# EAGLE design G27InterfaceBoard (EAGLE 9.6.2)
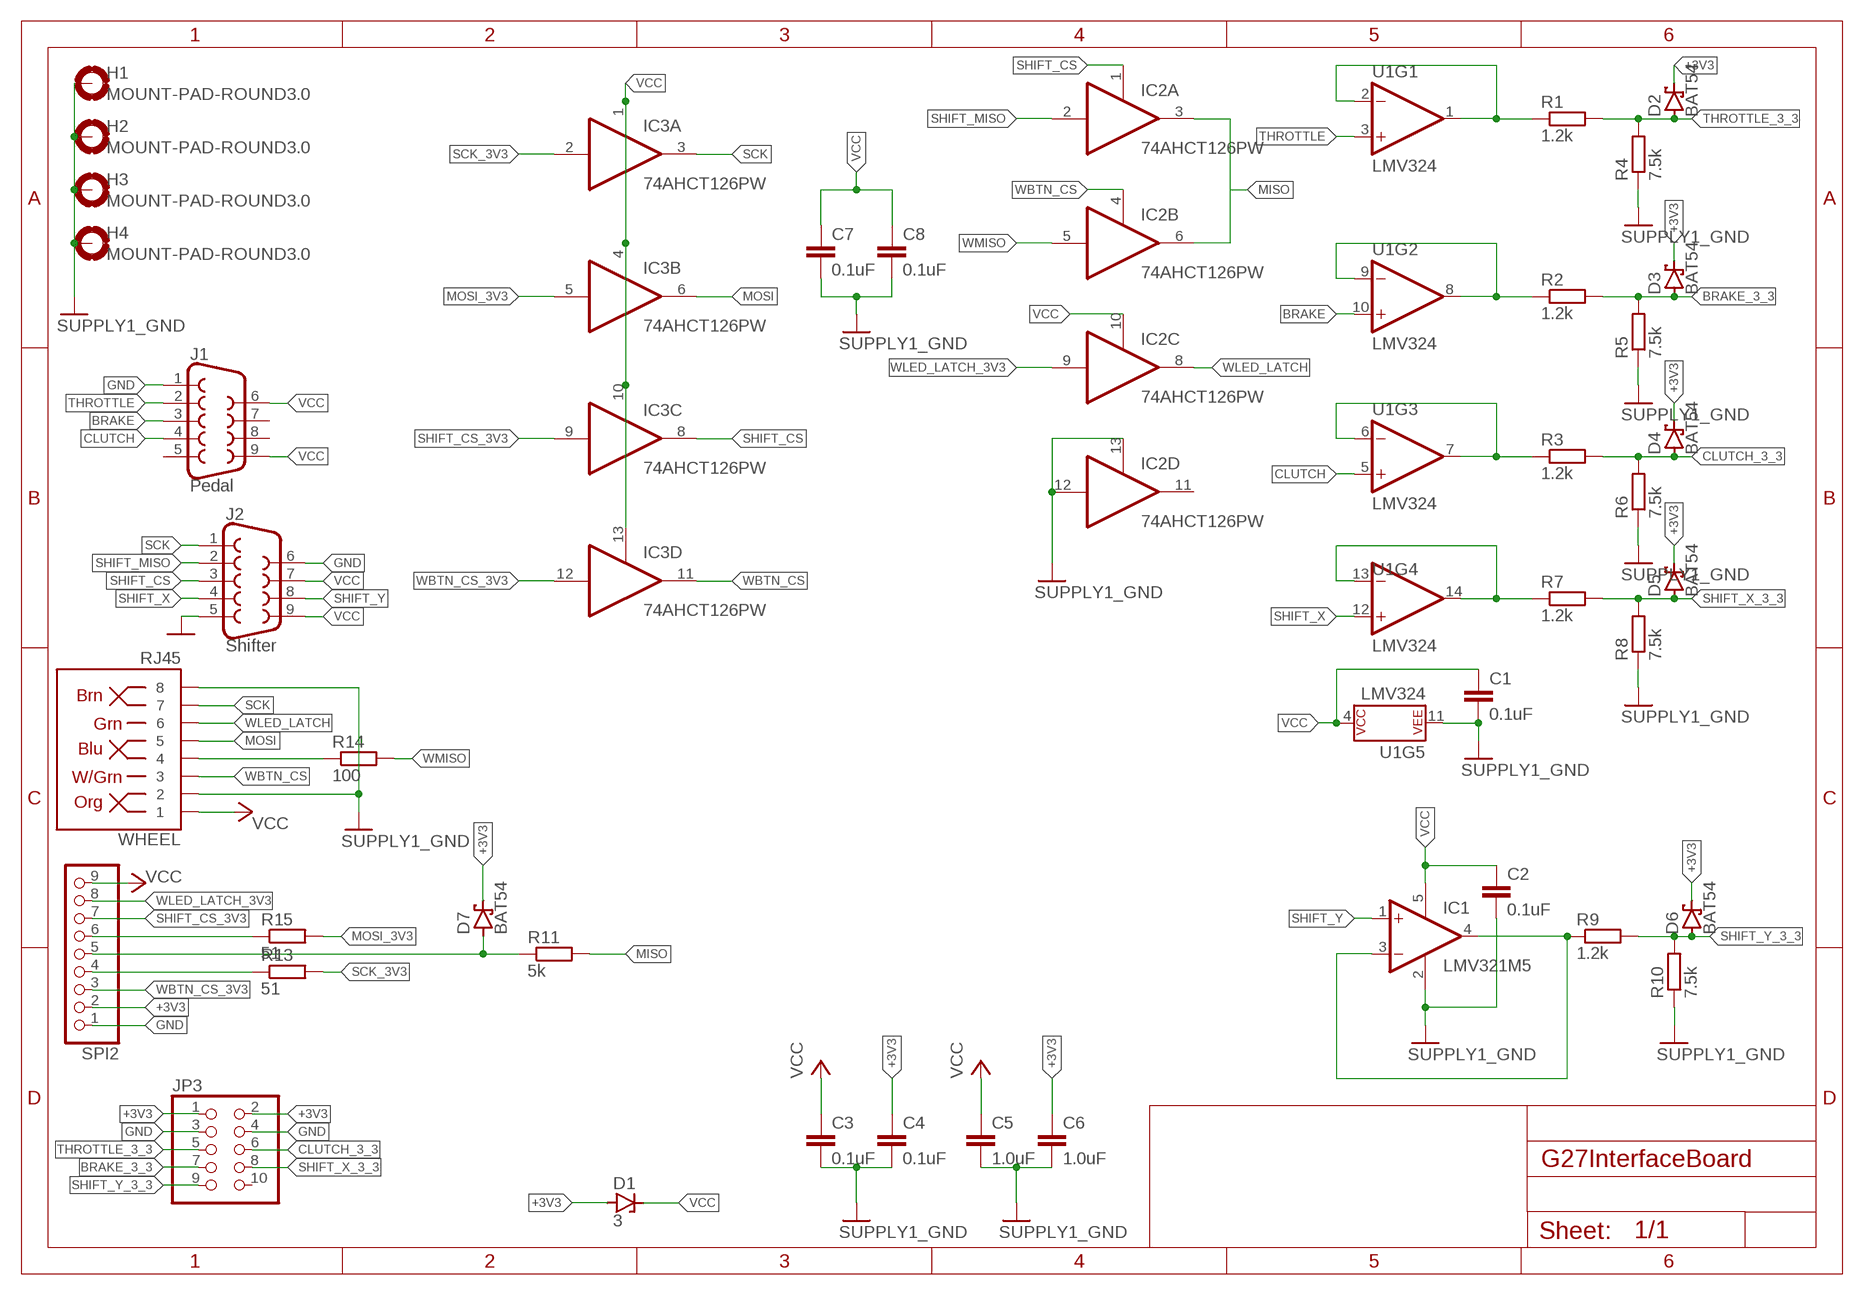
[diagram p0: schematic, sheet 1]

## Parts
C1  0.1uF  RESISTOR_C-EUC0603  [RESISTOR_C0603]
C2  0.1uF  RESISTOR_C-EUC0603  [RESISTOR_C0603]
C3  0.1uF  C-EUC0805  [C0805]
C4  0.1uF  C-EUC0805  [C0805]
C5  1.0uF  C-EUC0805  [C0805]
C6  1.0uF  C-EUC0805  [C0805]
C7  0.1uF  C-EUC0603  [C0603]
C8  0.1uF  C-EUC0603  [C0603]
D1  3  ZENER-DIODESOT23  [SOT23]
D2  BAT54  [SOT23]
D3  BAT54  [SOT23]
D4  BAT54  [SOT23]
D5  BAT54  [SOT23]
D6  BAT54  [SOT23]
D7  BAT54  [SOT23]
H1  MOUNT-PAD-ROUND3.0  [3,0-PAD]
H2  MOUNT-PAD-ROUND3.0  [3,0-PAD]
H3  MOUNT-PAD-ROUND3.0  [3,0-PAD]
H4  MOUNT-PAD-ROUND3.0  [3,0-PAD]
IC1  LMV321M5  [SOT23-5]
IC2  74AHCT126PW  [TSSOP14]
IC3  74AHCT126PW  [TSSOP14]
J1  Pedal  DB9FEMALE  [DB9]
J2  Shifter  DB9MALE  [DB9_MALE]
JP3  PINHEAD_PINHD-2X5  [PINHEAD_2X05]
R1  1.2k  R-EU_R0603  [R0603]
R2  1.2k  R-EU_R0603  [R0603]
R3  1.2k  R-EU_R0603  [R0603]
R4  7.5k  R-EU_R0603  [R0603]
R5  7.5k  R-EU_R0603  [R0603]
R6  7.5k  R-EU_R0603  [R0603]
R7  1.2k  R-EU_R0603  [R0603]
R8  7.5k  R-EU_R0603  [R0603]
R9  1.2k  R-EU_R0603  [R0603]
R10  7.5k  R-EU_R0603  [R0603]
R11  5k  R-EU_R0603  [R0603]
R13  51  R-EU_R0603  [R0603]
R14  100  R-EU_R0603  [R0603]
R15  51  R-EU_R0603  [R0603]
SPI2  PINHD-1X9  [1X09]
U1  LMV324  [SO14]
WHEEL  RJ45  RJ45-8  [RJ45-8]

## Nets
+3V3: C4.1 C6.1 D1.1(A) D2.3(C) D3.3(C) D4.3(C) D5.3(C) D6.3(C) D7.3(C) JP3.1 JP3.2 SPI2.2
BRAKE: J1.3 U1.10(+IN)
BRAKE_3_3: D3.1(A) JP3.7 R2.2 R5.2
CLUTCH: J1.4 U1.5(+IN)
CLUTCH_3_3: D4.1(A) JP3.6 R3.2 R6.2
GND: C1.2 C2.2 C3.2 C4.2 C5.2 C6.2 C7.2 C8.2 H1.B3,0(MOUNT) H2.B3,0(MOUNT) H3.B3,0(MOUNT) H4.B3,0(MOUNT) IC1.2(V-) IC2.12(D:I) IC2.13(D:OE) J1.1 J2.5 J2.6 JP3.3 JP3.4 R4.1 R5.1 R6.1 R8.1 R10.1 SPI2.1 U1.11(P$V-) WHEEL.2 WHEEL.8 ; supply symbol labelled SUPPLY1_GND
MISO: IC2.3(A:O) IC2.6(B:O) R11.2
MOSI: IC3.6(B:O) WHEEL.5
MOSI_3V3: IC3.5(B:I) R15.2
N$1: R1.1 U1.1(OUT) U1.2(-IN)
N$2: R7.1 U1.13(-IN) U1.14(OUT)
N$3: IC1.3(-IN) IC1.4(OUT) R9.1
N$4: D7.1(A) R11.1 SPI2.5
N$5: R2.1 U1.8(OUT) U1.9(-IN)
N$6: R3.1 U1.6(-IN) U1.7(OUT)
N$8: R13.1 SPI2.4
N$9: R14.1 WHEEL.4
N$10: R15.1 SPI2.6
SCK: IC3.3(A:O) J2.1 WHEEL.7
SCK_3V3: IC3.2(A:I) R13.2
SHIFT_CS: IC2.1(A:OE) IC3.8(C:O) J2.3
SHIFT_CS_3V3: IC3.9(C:I) SPI2.7
SHIFT_MISO: IC2.2(A:I) J2.2
SHIFT_X: J2.4 U1.12(+IN)
SHIFT_X_3_3: D5.1(A) JP3.8 R7.2 R8.2
SHIFT_Y: IC1.1(+IN) J2.8
SHIFT_Y_3_3: D6.1(A) JP3.9 R9.2 R10.2
THROTTLE: J1.2 U1.3(+IN)
THROTTLE_3_3: D2.1(A) JP3.5 R1.2 R4.2
VCC: C1.1 C2.1 C3.1 C5.1 C7.1 C8.1 D1.3(C) IC1.5(V+) IC2.10(C:OE) IC3.1(A:OE) IC3.4(B:OE) IC3.10(C:OE) IC3.13(D:OE) J1.6 J1.9 J2.7 J2.9 SPI2.9 U1.4(P$V+) WHEEL.1
WBTN_CS: IC2.4(B:OE) IC3.11(D:O) WHEEL.3
WBTN_CS_3V3: IC3.12(D:I) SPI2.3
WLED_LATCH: IC2.8(C:O) WHEEL.6
WLED_LATCH_3V3: IC2.9(C:I) SPI2.8
WMISO: IC2.5(B:I) R14.2
Unconnected: IC2.11(D:O) J1.5 J1.7 J1.8 JP3.10

## Power pins joined to a net without a drawn wire
GND: IC2.7(P:GND) IC3.7(P:GND)
VCC: IC2.14(P:VCC) IC3.14(P:VCC)

## Library data of the parts
C1 C2 = stm_board_f407:RESISTOR_C-EU: CAPACITOR, European symbol
C3-C8 = resistor:C-EU: CAPACITOR, European symbol
D1 = diode:ZENER-DIODE: Z-Diode; SPICEPREFIX: D
D2-D7 = diode:BAT54: Schottky Diodes Source: Fairchild .. BAT54.pdf
H1-H4 = holes:MOUNT-PAD-ROUND: MOUNTING PAD, round
IC1 = linear:LMV321?*: General Purpose, Low Voltage, Rail-to-Rail Output Operational Amplifiers Source: http://www.national.com/mpf/LM/LMV321.html http://www.national.com/dt/lmv_qual.pdf
IC2 IC3 = 74xx-eu:74*126: Quad bus BUFFER, 3-state
J1 = SparkFun-Connectors:DB9: DB9 Connector Standard DB9 (D-Sub 9) serial connector. Can be used for CAN bus as well as RS485 and RS232. Footprint production proven. Here is the female version connector we sell at SparkFun: 9 Pin Female Serial Connector - PCB Mount <https://www.sparkfun.com/products/429> (PRT-00429) This connector has been used on the following SparkFun products: SparkFun RS232 Shifter - SMD <https://www.sparkfun.com/products/449> (PRT-00449) SparkFun RS232 Shifter SMD (No DB9) <https://www.sparkfun.com/products/8780> (PRT-08780); PROD_ID: CONN-08194
J2 = SparkFun-Connectors:DB9: DB9 Connector Standard DB9 (D-Sub 9) serial connector. Can be used for CAN bus as well as RS485 and RS232. Footprint production proven. Here is the female version connector we sell at SparkFun: 9 Pin Female Serial Connector - PCB Mount <https://www.sparkfun.com/products/429> (PRT-00429) This connector has been used on the following SparkFun products: SparkFun RS232 Shifter - SMD <https://www.sparkfun.com/products/449> (PRT-00449) SparkFun RS232 Shifter SMD (No DB9) <https://www.sparkfun.com/products/8780> (PRT-08780); PROD_ID: CONN-09904
JP3 = stm_board_f407:PINHEAD_PINHD-2X5: PIN HEADER
R1-R11 R13-R15 = resistor:R-EU_: RESISTOR, European symbol
SPI2 = pinhead:PINHD-1X9: PIN HEADER
U1 = SparkFun-IC-Amplifiers:LMV324: IC LMV324 Quad Op Amp Jellybean quad op-amp Datasheet <http://cdn.sparkfun.com/datasheets/Sensors/Sound/LMV324.pdf> SparkFun Products SparkFun Sensor Kit <https://www.sparkfun.com/products/13754> (DEV-13754) SparkFun Inventor's Kit for Arduino 101 <https://www.sparkfun.com/products/13844> (KIT-13844) SparkFun Sound Detector <https://www.sparkfun.com/products/12642> (SEN-12642); PROD_ID: IC-08227
WHEEL = SparkFun-Connectors:RJ45-8: RJ45 Jack - 8 pin Simple RJ45, 8-pin connection. Commonly used for Cat5, Cat5e, and Cat6 Ethernet cables. Here is the connector we sell at SparkFun: RJ45 8-Pin Connector <https://www.sparkfun.com/products/643> (PRT-00643) Datasheet <https://cdn.sparkfun.com/datasheets/Prototyping/04908.pdf> It is used on this SparkFun product: SparkFun RJ45 Breakout <https://www.sparkfun.com/products/716> (BOB-00716) Note, you may also be interested in the "MAGJACK" version of this. It is basically a RJ45 connector, but also has some status LEDs built into the connector housing. You can check that out in this library at the device named "MAGJACK.dev" and see these products online: RJ45 Ethernet MagJack-Compatible <https://www.sparkfun.com/products/8534> (PRT-08534) SparkFun RJ45 MagJack Breakout <https://www.sparkfun.com/products/13021> (BOB-13021); PROD_ID: CONN-08506; SF_ID: PRT-00643

## Board
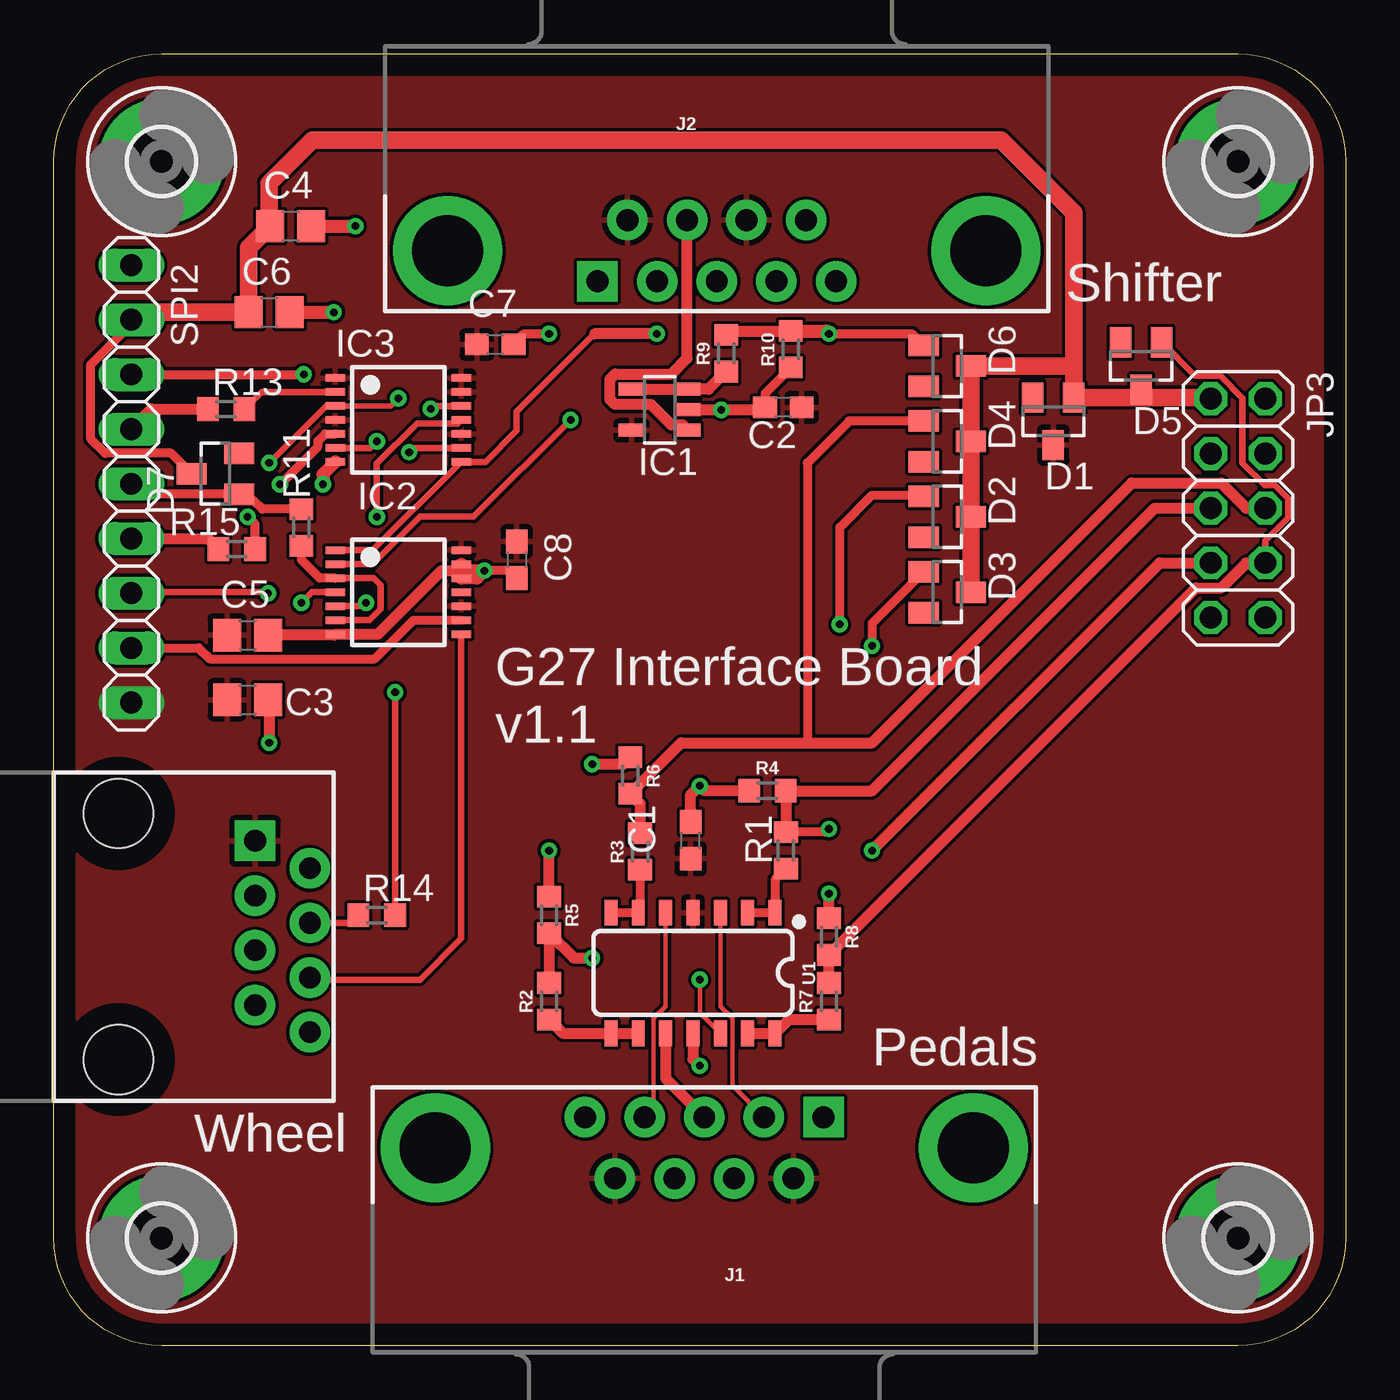
[diagram p1: board, top side]
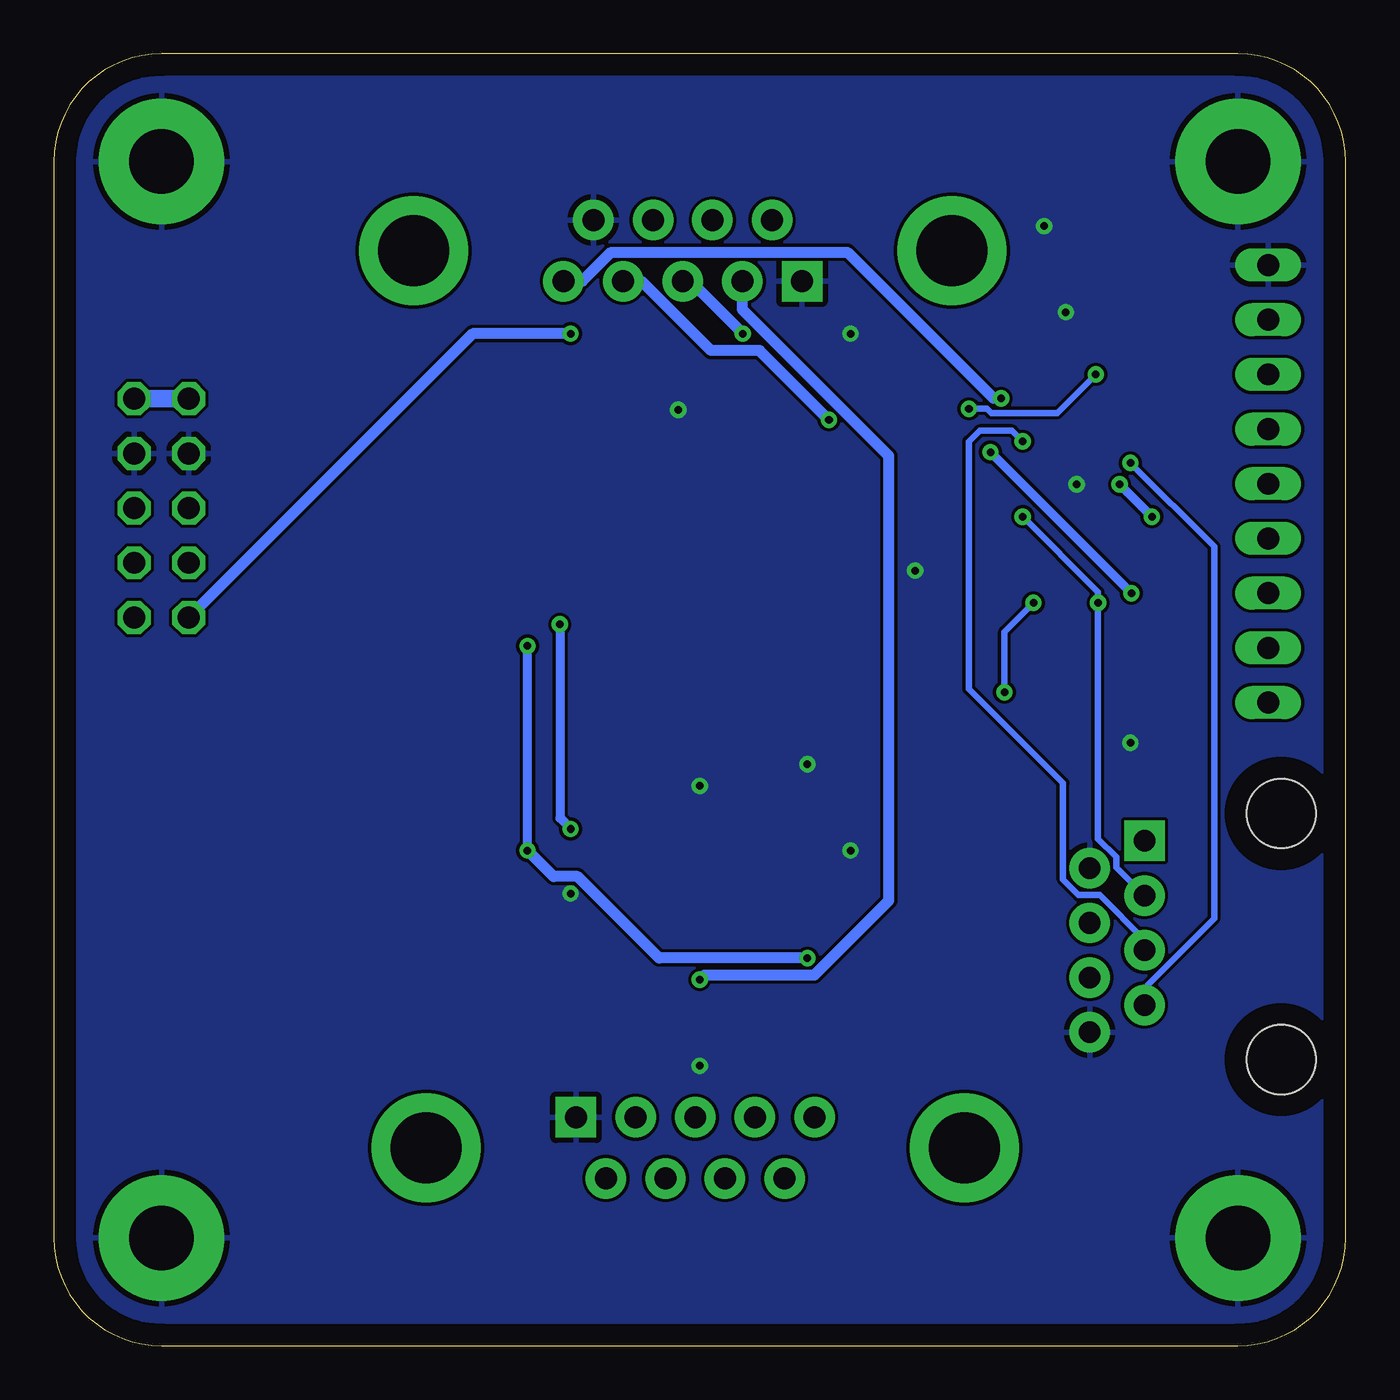
[diagram p2: board, bottom side, seen from below]

Size 60 x 60 mm. Coordinates in mm from the lower left corner, seen from the top.
Outline: 55,0 5,0 arc-90 0,5 0,55 arc-90 5,60 55,60 arc-90 60,55 60,5 arc-90 55,0
Copper layers (1*16): Top 0.035mm / dielectric 1.5mm / Bottom 0.035mm
Design rules "jlcpcb": minimum track width 5mil, minimum drill 0.3mm, track to track 6mil, track to pad 6mil, pad to pad 6mil, via to via 6mil, smd to smd 6mil, copper to edge 40mil, drill to drill 6mil, minimum pad ring 10mil, minimum via ring 8mil, stop-mask expansion 4mil, vias tented up to drill 0mil, thermal gap 10mil

### Footprints (pad centres in the part's own frame; a part is rotated, then mirrored left to right if it is on the bottom)
RESISTOR_C0603 = smd 1.1 x 1: 1 -0.85,0; 2 0.85,0
C0805 = smd 1.3 x 1.5: 1 -0.95,0; 2 0.95,0
C0603 = smd 1.1 x 1: 1 -0.85,0; 2 0.85,0
SOT23 = smd 1 x 1.4: 1 -0.95,-1.1; 2 0.95,-1.1; 3 0,1.1
3,0-PAD = drill 3 pad 5.842: B3,0 0,0
SOT23-5 = smd 0.6 x 1.2: 1 -0.95,-1.306; 2 0,-1.306; 3 0.95,-1.306; 4 0.95,1.306; 5 -0.95,1.306
TSSOP14 = smd 0.35 x 0.9: 1 -1.95,-2.925; 2 -1.3,-2.925; 3 -0.65,-2.925; 4 0,-2.925; 5 0.65,-2.925; 6 1.3,-2.925; 7 1.95,-2.925; 8 1.95,2.925; 9 1.3,2.925; 10 0.65,2.925; 11 0,2.925; 12 -0.65,2.925; 13 -1.3,2.925; 14 -1.95,2.925
DB9 = drill 1.016 pad 1.88 square: 1 -5.54,-1.42 | drill 1.016 pad 1.88: 2 -2.77,-1.42; 3 0,-1.42; 4 2.77,-1.42; 5 5.54,-1.42; 6 -4.15,1.42; 7 -1.38,1.42; 8 1.38,1.42; 9 4.15,1.42 | drill 3.302 pad 5.08: G1 -12.5,0; G2 12.5,0
DB9_MALE = drill 1.016 pad 1.88: 1 5.54,-1.42; 2 2.77,-1.42; 3 0,-1.42; 4 -2.77,-1.42; 6 4.15,1.42; 7 1.38,1.42; 8 -1.38,1.42; 9 -4.15,1.42 | drill 1.016 pad 1.88 square: 5 -5.54,-1.42 | drill 3.302 pad 5.08: G1 -12.5,0; G2 12.5,0
PINHEAD_2X05 = drill 1.016 octagon: 1 -5.08,-1.27; 2 -5.08,1.27; 3 -2.54,-1.27; 4 -2.54,1.27; 5 0,-1.27; 6 0,1.27; 7 2.54,-1.27; 8 2.54,1.27; 9 5.08,-1.27; 10 5.08,1.27
R0603 = smd 1 x 1.1: 1 -0.85,0; 2 0.85,0
1X09 = drill 1.016 long: 1 -10.16,0; 2 -7.62,0; 3 -5.08,0; 4 -2.54,0; 5 0,0; 6 2.54,0; 7 5.08,0; 8 7.62,0; 9 10.16,0
SO14 = smd 0.6 x 1.2: 1 -3.175,-2.8; 2 -1.905,-2.8; 3 -0.635,-2.8; 4 0.635,-2.8; 5 1.905,-2.8; 6 3.175,-2.8; 7 4.445,-2.8; 8 4.445,2.8; 9 3.175,2.8; 10 1.905,2.8; 11 0.635,2.8; 12 -0.635,2.8; 13 -1.905,2.8; 14 -3.175,2.8
RJ45-8 = drill 1 pad 1.88 square: 1 -4.445,6.35 | drill 1 pad 1.88: 2 -3.175,8.89; 3 -1.905,6.35; 4 -0.635,8.89; 5 0.635,6.35; 6 1.905,8.89; 7 3.175,6.35; 8 4.445,8.89 | hole 3.2: -5.715,0; 5.715,0

### Placement (x,y rotation side)
C1  29.58,23.47 90 top
C2  33.88,43.58 180 top
C3  9,30 0 top
C4  11,52 0 top
C5  9,33 0 top
C6  10,48 0 top
C7  20.5,46.5 0 top
C8  21.5,36.5 270 top
D1  46.42,42.93 180 top
D2  41.5,38.5 270 top
D3  41.5,35 270 top
D4  41.5,42 270 top
D5  50.5,45.5 180 top
D6  41.5,45.5 270 top
D7  7.5,40.5 90 top
H1  5,5 0 top
H2  5,55 0 top
H3  55,5 0 top
H4  55,55 0 top
IC1  28.14,43.47 90 top
IC2  16,35 270 top
IC3  16,43 270 top
J1  30.21,9.19 180 top
J2  30.79,50.86 0 top
JP3  55,38.9 270 top
R1  34,23 90 top
R2  23,16 90 top
R3  27.23,22.95 90 top
R4  33.14,25.77 0 top
R5  23,20 270 top
R6  26.77,26.48 270 top
R7  36,16 90 top
R8  36,19 270 top
R9  31.23,46.09 90 top
R10  34.23,46.28 90 top
R11  11.5,38 270 top
R13  8,43.5 0 top
R14  15,20 0 top
R15  8.5,37 0 top
SPI2  3.6,40.03 270 top
U1  30.32,17.31 180 top
WHEEL  3,19 270 top

### Tracks (layer width: path | path; a pad name or v marks a point on that pad's centre or on a via)
+3V3
  Top 0.406: D5.3 50.5,44.03 | D7.3 5.45,41.45 2.38,41.45 1.72,42.11 1.72,45.57 3.6,47.45 SPI2.2
  Top 0.508: JP3.1 53.68,44.03
  Top 0.813: 53.68,44.03 50.5,44.03 D1.1 47.37,45.5 | 47.37,45.5 47.37,52.63 44,56 12,56 10,54 10,52.05 C4.1 9.05,51 C6.1 3.95,48 SPI2.2 | 47.37,45.5 D6.3 D4.3 D2.3 D3.3
  Bottom 0.813: JP3.2 JP3.1
BRAKE
  Top 0.508: U1.10 28.41,12.41 J1.3
BRAKE_3_3  (via drill 0.35)
  Top 0.406: D3.1 38,33.55 v38,32.5
  Top 0.508: R2.2 R5.2 24.15,18 v25,18 | JP3.7 51.36,36.36 v38,23
  Bottom 0.406: v38,23 v38,32.5
  Bottom 0.508: v38,23 36.78,21.78 35.67,21.78 31.89,18 v25,18
CLUTCH
  Top 0.203: U1.5 28.41,15.77 27.86,15.22 27.86,11.03 J1.4
CLUTCH_3_3
  Top 0.406: D4.1 36.95,42.95 35,41 35,28
  Top 0.508: R3.2 27.23,25.17 R6.2 29.14,28 35,28 38,28 50.07,40.07 54.21,40.07 55.38,38.9 JP3.6
GND  (via drill 0.35)
  Top 0.305: IC2.7 13.03,33
  Top 0.406: R10.1 33.03,44.23 C2.2 | C8.2 21.15,36 v20,36 | C7.2 21.85,47 v23,47
  Top 0.508: R8.1 v36,21 | IC1.2 v31,43.47 32.92,43.47 C2.2 | C1.2 29.58,25.58 v30,26 30.23,25.77 R4.1 | R5.1 v23,23 | U1.11 29.68,13.31 v30,13 | R6.1 26.44,27 v25,27 | IC2.7 15.05,33.05 18,36 19.23,36 | 13.03,33 C5.2 | C3.2 10,29.95 v10,28
  Top 0.61: C4.2 v14,52 | C6.2 v13,48 | IC3.7 12.5,40.48 v12.5,40 | IC2.13 19.23,36 v20,36 19.65,35.65 IC2.12
  pour Bottom: -3,61 61,61 61,-1 -3,-1
MISO
  Top 0.305: IC2.3 14.85,35.65 15.18,35.32 15.18,34.22 14.67,33.7 IC2.6
  Top 0.406: IC2.3 12.35,35.65 11.5,36.5 R11.2
MOSI  (via drill 0.35)
  Top 0.305: v15,42 14.7,41.7 IC3.6
  Bottom 0.305: WHEEL.5 9.35,18.85 11.43,20.93 12.41,20.93 13.13,21.66 13.13,26.13 17.5,30.5 17.5,42 17,42.5 15.5,42.5 v15,42
MOSI_3V3  (via drill 0.35)
  Top 0.406: R15.2 9.35,38.15 v9,38.5 | v10.5,40 12.27,41.77 12.27,42.02 12.6,42.35 IC3.5
  Bottom 0.406: v9,38.5 v10.5,40
N$1
  Top 0.406: R1.1 33.49,21.65 U1.1 U1.2
N$2
  Top 0.508: U1.13 U1.14 33.84,14.86 34.13,15.15 R7.1
N$3
  Top 0.508: IC1.4 29,44.42 IC1.3 30.41,44.42 R9.1
N$4
  Top 0.406: R11.1 9.69,38.85 9.3,39.23 8.92,39.23 D7.1 4.08,39.55 SPI2.5
N$5
  Top 0.508: R2.1 23.64,14.51 U1.8 U1.9
N$6
  Top 0.406: R3.1 27.23,20.2 U1.6 U1.7
N$8
  Top 0.508: SPI2.4 4.53,43.5 R13.1
N$9
  Top 0.305: R14.1 13.79,19.63 WHEEL.4
N$10
  Top 0.508: SPI2.6 7.16,37.49 R15.1
SCK  (via drill 0.35)
  Top 0.254: v16,44 15.65,43.65 IC3.3
  Top 0.305: v10,41 12.65,43.65 IC3.3
  Bottom 0.305: WHEEL.7 9.35,16.6 6.11,19.85 6.11,37.11 v10,41
  Bottom 0.508: J2.1 35.46,49.44 34.12,50.79 23.14,50.79 16.36,44 v16,44
SCK_3V3
  Top 0.305: R13.2 9.65,44.3 IC3.2
SHIFT_CS  (via drill 0.35)
  Top 0.305: 25.12,47 21.5,43.38 21.5,42.5 20.05,41.05 IC3.8 16.83,38.96 16.81,38.96 14.8,36.95 IC2.1
  Top 0.508: v28,47 25.12,47
  Bottom 0.508: v28,47 30.44,49.44 J2.3
SHIFT_CS_3V3  (via drill 0.35)
  Top 0.305: IC3.9 16.7,41.7 v16.5,41.5 | SPI2.7 3.65,35 10,35 v9.95,34.95
  Bottom 0.406: v9.95,34.95 v16.5,41.5
SHIFT_MISO  (via drill 0.35)
  Top 0.305: v24,43 19.5,38.5 17,38.5 14.8,36.3 IC2.2
  Bottom 0.508: v24,43 27.21,46.22 29.47,46.22 32.69,49.44 J2.2
SHIFT_X  (via drill 0.35)
  Top 0.203: U1.12 30,15.47 v30,17
  Bottom 0.508: v30,17 29.79,17.22 24.68,17.22 21.21,20.67 21.21,41.33 28.02,48.13 J2.4
SHIFT_X_3_3
  Top 0.305: D5.1 53,45.05 54.17,45.05 55.2,44.02 55.2,41 56.23,39.97 56.71,39.97 57.34,39.34 57.34,38.46 56.27,37.39 JP3.8
  Top 0.508: R7.2 R8.2 53.04,35.19 54.21,35.19 55.38,36.36 JP3.8
SHIFT_Y
  Top 0.508: J2.8 29.41,45.86 28.68,45.13 26.07,45.13 25.83,44.89 25.83,43.95 26.07,43.71 27.73,43.71 28.68,42.76 29.2,42.76 IC1.1
SHIFT_Y_3_3  (via drill 0.35)
  Top 0.406: v36,47 39.85,47 D6.1
  Top 0.508: R9.2 31.42,47.13 R10.2
  Top 0.61: R10.2 35.87,47.13 v36,47
  Bottom 0.508: v36,47 40.55,47 JP3.9
THROTTLE
  Top 0.203: U1.3 30.95,15.77 31.51,15.22 31.51,12.08 J1.2
THROTTLE_3_3  (via drill 0.35)
  Top 0.406: v36,24 35.85,23.85 R1.2 | v36.5,33.5 36.5,38 38,39.5 40.35,39.5 D2.1
  Top 0.508: R1.2 R4.2 38.01,25.77 51.13,38.9 JP3.5
  Bottom 0.406: v36.5,33.5 36.5,24.5 v36,24
VCC
  pour Top: -3,62 61,62 61,-2 -3,-2
  pour Top (no thermals): 1.5,31 1.5,28 5.5,28 5.5,31
WBTN_CS  (via drill 0.35)
  Top 0.305: IC3.11 18.75,42.83 16.86,42.83 15,40.97 v15,38.5 | v11.5,34.5 12,35 IC2.4
  Bottom 0.305: v15,38.5 11.5,35 v11.5,34.5 11.5,23.55 10.64,22.69 10.64,22.2 WHEEL.3
WBTN_CS_3V3  (via drill 0.35)
  Top 0.305: v17.5,43.51 17.64,43.65 IC3.12
  Top 0.406: SPI2.3 v11.61,45.11
  Bottom 0.305: v17.5,43.51 16.66,43.51 16.46,43.32 13.4,43.32 v11.61,45.11
WLED_LATCH
  Top 0.305: IC2.8 18.93,18.92 17,17 11.98,17 WHEEL.6
WLED_LATCH_3V3
  Top 0.406: SPI2.8 6.74,32.41 7.25,31.89 14.89,31.89 16.7,33.7 IC2.9
WMISO  (via drill 0.35)
  Top 0.305: R14.2 v15.85,30.35 | v14.5,34.5 14.35,34.35 IC2.5
  Bottom 0.305: v15.85,30.35 15.85,33.15 v14.5,34.5

### Text on the board
tNames: Shifter | G27 Interface Board / v1.1 | Pedals | Wheel